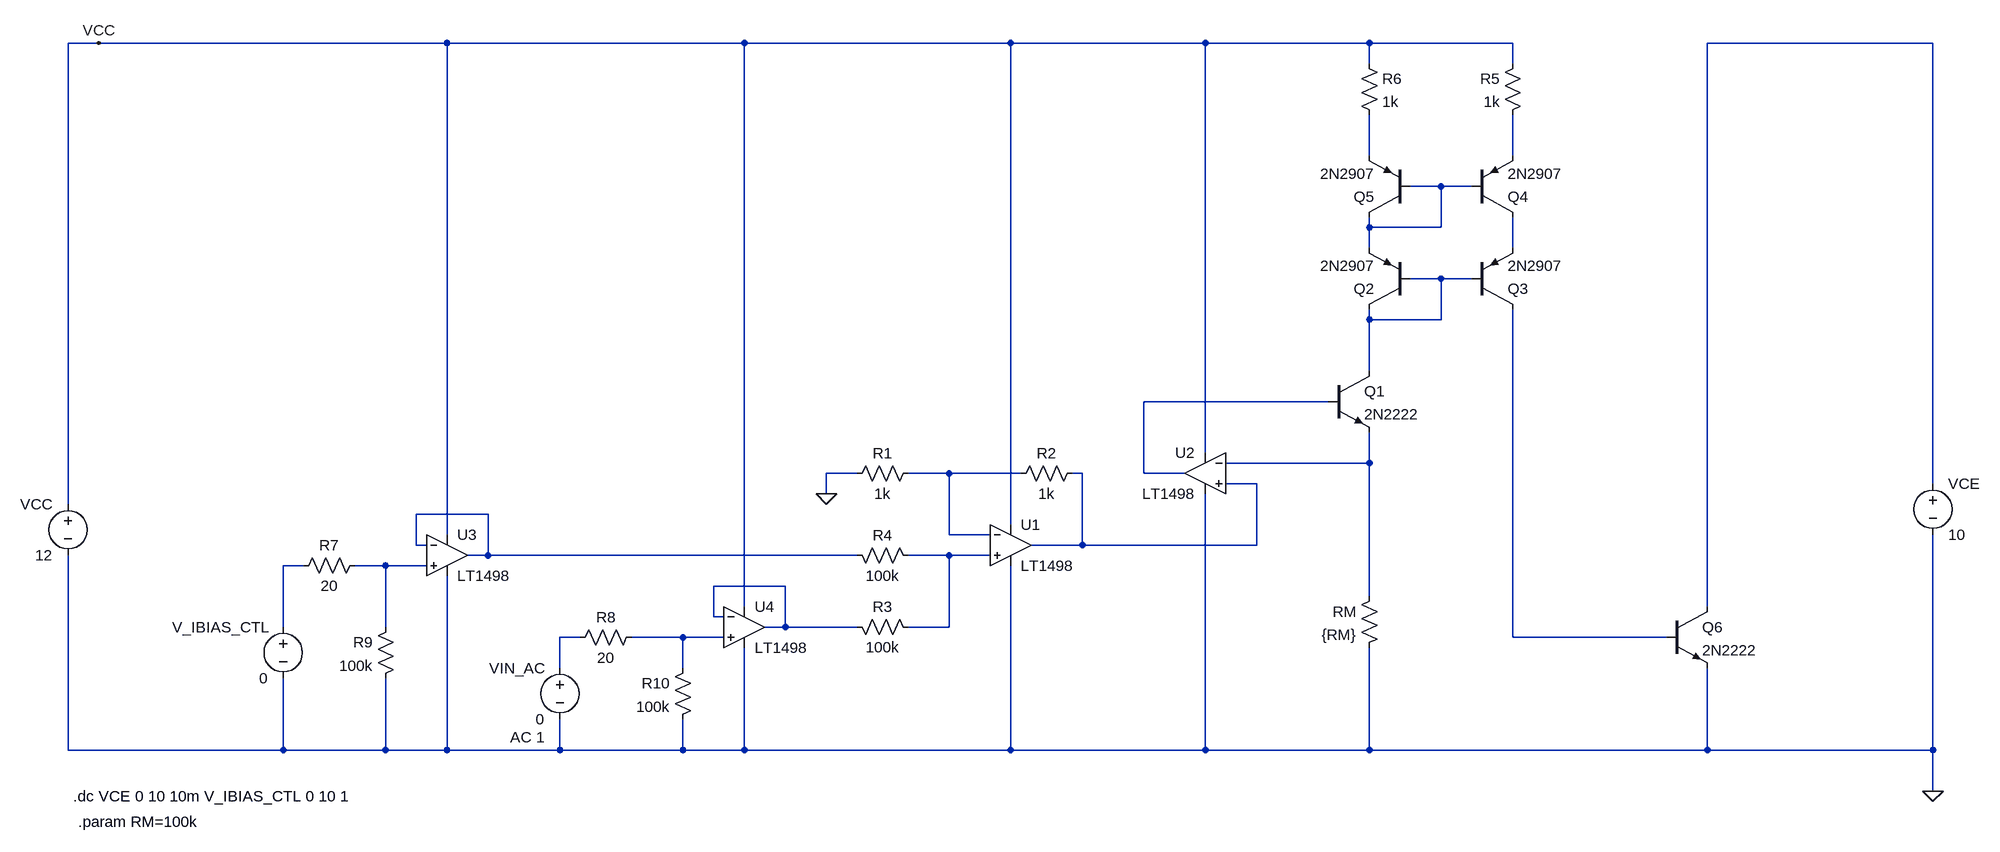
[diagram p0: schematic Draft1.asc]
Draft1.asc, the LTspice schematic file:
Version 4.1
SHEET 1 880 688
WIRE -2432 -544 -2480 -544
WIRE -1888 -544 -2432 -544
WIRE -1424 -544 -1888 -544
WIRE -1008 -544 -1424 -544
WIRE -704 -544 -1008 -544
WIRE -448 -544 -704 -544
WIRE -224 -544 -448 -544
WIRE 432 -544 80 -544
WIRE -448 -512 -448 -544
WIRE -224 -512 -224 -544
WIRE -448 -368 -448 -432
WIRE -224 -368 -224 -432
WIRE -336 -320 -384 -320
WIRE -288 -320 -336 -320
WIRE -448 -256 -448 -272
WIRE -336 -256 -336 -320
WIRE -336 -256 -448 -256
WIRE -448 -224 -448 -256
WIRE -224 -224 -224 -272
WIRE -336 -176 -384 -176
WIRE -288 -176 -336 -176
WIRE -448 -112 -448 -128
WIRE -336 -112 -336 -176
WIRE -336 -112 -448 -112
WIRE -448 -32 -448 -112
WIRE -512 16 -800 16
WIRE -704 96 -704 -544
WIRE -448 112 -448 64
WIRE -448 112 -672 112
WIRE -1248 128 -1296 128
WIRE -1104 128 -1168 128
WIRE -992 128 -1104 128
WIRE -896 128 -912 128
WIRE -800 128 -800 16
WIRE -736 128 -800 128
WIRE -624 144 -672 144
WIRE 432 144 432 -544
WIRE -1296 160 -1296 128
WIRE -2480 176 -2480 -544
WIRE -1824 192 -1936 192
WIRE -1008 208 -1008 -544
WIRE -1888 224 -1888 -544
WIRE -1104 224 -1104 128
WIRE -1040 224 -1104 224
WIRE -1936 240 -1936 192
WIRE -1920 240 -1936 240
WIRE -896 240 -896 128
WIRE -896 240 -976 240
WIRE -624 240 -624 144
WIRE -624 240 -896 240
WIRE -1824 256 -1824 192
WIRE -1824 256 -1856 256
WIRE -1248 256 -1824 256
WIRE -1104 256 -1168 256
WIRE -1040 256 -1104 256
WIRE -2112 272 -2144 272
WIRE -1984 272 -2032 272
WIRE -1920 272 -1984 272
WIRE -1360 304 -1472 304
WIRE -448 320 -448 112
WIRE -1424 336 -1424 -544
WIRE 80 336 80 -544
WIRE -1472 352 -1472 304
WIRE -1456 352 -1472 352
WIRE -2144 368 -2144 272
WIRE -1984 368 -1984 272
WIRE -1360 368 -1360 304
WIRE -1360 368 -1392 368
WIRE -1248 368 -1360 368
WIRE -1104 368 -1104 256
WIRE -1104 368 -1168 368
WIRE -1680 384 -1712 384
WIRE -1520 384 -1600 384
WIRE -1456 384 -1520 384
WIRE -224 384 -224 -128
WIRE 16 384 -224 384
WIRE -1712 432 -1712 384
WIRE -1520 432 -1520 384
WIRE -2480 560 -2480 256
WIRE -2144 560 -2144 448
WIRE -2144 560 -2480 560
WIRE -1984 560 -1984 448
WIRE -1984 560 -2144 560
WIRE -1888 560 -1888 288
WIRE -1888 560 -1984 560
WIRE -1712 560 -1712 512
WIRE -1712 560 -1888 560
WIRE -1520 560 -1520 512
WIRE -1520 560 -1712 560
WIRE -1424 560 -1424 400
WIRE -1424 560 -1520 560
WIRE -1008 560 -1008 272
WIRE -1008 560 -1424 560
WIRE -704 560 -704 160
WIRE -704 560 -1008 560
WIRE -448 560 -448 400
WIRE -448 560 -704 560
WIRE 80 560 80 432
WIRE 80 560 -448 560
WIRE 432 560 432 224
WIRE 432 560 80 560
WIRE 432 624 432 560
FLAG 432 624 0
FLAG -1296 160 0
FLAG -2432 -544 VCC
SYMBOL voltage 432 128 R0
WINDOW 123 0 0 Left 0
WINDOW 39 0 0 Left 0
SYMATTR InstName VCE
SYMATTR Value 10
SYMBOL npn -512 -32 R0
SYMATTR InstName Q1
SYMATTR Value 2N2222
SYMBOL voltage -2480 160 M0
WINDOW 123 0 0 Left 0
WINDOW 39 0 0 Left 0
SYMATTR InstName VCC
SYMATTR Value 12
SYMBOL OpAmps\\LT1498 -1008 176 R0
SYMATTR InstName U1
SYMBOL voltage -2144 352 M0
WINDOW 123 0 0 Left 0
WINDOW 39 0 0 Left 0
SYMATTR InstName V_IBIAS_CTL
SYMATTR Value 0
SYMBOL res -432 304 M0
SYMATTR InstName RM
SYMATTR Value {RM}
SYMBOL OpAmps\\LT1498 -704 64 M0
SYMATTR InstName U2
SYMBOL res -1264 144 R270
WINDOW 0 32 56 VTop 2
WINDOW 3 0 56 VBottom 2
SYMATTR InstName R1
SYMATTR Value 1k
SYMBOL voltage -1712 416 M0
WINDOW 123 24 124 Left 2
WINDOW 39 0 0 Left 0
SYMATTR InstName VIN_AC
SYMATTR Value 0
SYMATTR Value2 AC 1
SYMBOL res -1008 144 R270
WINDOW 0 32 56 VTop 2
WINDOW 3 0 56 VBottom 2
SYMATTR InstName R2
SYMATTR Value 1k
SYMBOL res -1152 384 M270
WINDOW 0 32 56 VTop 2
WINDOW 3 0 56 VBottom 2
SYMATTR InstName R3
SYMATTR Value 100k
SYMBOL pnp -384 -128 R180
SYMATTR InstName Q2
SYMATTR Value 2N2907
SYMBOL pnp -288 -128 M180
SYMATTR InstName Q3
SYMATTR Value 2N2907
SYMBOL pnp -288 -272 M180
SYMATTR InstName Q4
SYMATTR Value 2N2907
SYMBOL pnp -384 -272 R180
SYMATTR InstName Q5
SYMATTR Value 2N2907
SYMBOL res -208 -528 M0
SYMATTR InstName R5
SYMATTR Value 1k
SYMBOL res -464 -528 R0
SYMATTR InstName R6
SYMATTR Value 1k
SYMBOL npn 16 336 R0
SYMATTR InstName Q6
SYMATTR Value 2N2222
SYMBOL res -1152 272 M270
WINDOW 0 32 56 VTop 2
WINDOW 3 0 56 VBottom 2
SYMATTR InstName R4
SYMATTR Value 100k
SYMBOL OpAmps\\LT1498 -1888 192 R0
SYMATTR InstName U3
SYMBOL OpAmps\\LT1498 -1424 304 R0
SYMATTR InstName U4
SYMBOL res -2128 288 R270
WINDOW 0 32 56 VTop 2
WINDOW 3 0 56 VBottom 2
SYMATTR InstName R7
SYMATTR Value 20
SYMBOL res -1696 400 R270
WINDOW 0 32 56 VTop 2
WINDOW 3 0 56 VBottom 2
SYMATTR InstName R8
SYMATTR Value 20
SYMBOL res -1968 352 M0
SYMATTR InstName R9
SYMATTR Value 100k
SYMBOL res -1504 416 M0
SYMATTR InstName R10
SYMATTR Value 100k
TEXT -2472 632 Left 2 !.dc VCE 0 10 10m V_IBIAS_CTL 0 10 1
TEXT -2464 672 Left 2 !.param RM=100k

The netlist it stands for:
* Draft1.asc
VCE N001 0 10
Q1 N006 N007 N008 0 2N2222
VCC VCC 0 12
X§U1 N012 N009 VCC 0 N010 LT1498  ; pins In+ In- V+ V- OUT
V_IBIAS_CTL N013 0 0
RM N008 0 {RM}
X§U2 N010 N008 VCC 0 N007 LT1498  ; pins In+ In- V+ V- OUT
R1 0 N009 1k
VIN_AC N016 0 0 AC 1
R2 N009 N010 1k
R3 N012 N015 100k
Q2 N006 N006 N004 0 2N2907
Q3 N018 N006 N005 0 2N2907
Q4 N005 N004 N003 0 2N2907
Q5 N004 N004 N002 0 2N2907
R5 VCC N003 1k
R6 VCC N002 1k
Q6 N001 N018 0 0 2N2222
R4 N012 N011 100k
X§U3 N014 N011 VCC 0 N011 LT1498  ; pins In+ In- V+ V- OUT
X§U4 N017 N015 VCC 0 N015 LT1498  ; pins In+ In- V+ V- OUT
R7 N013 N014 20
R8 N016 N017 20
R9 N014 0 100k
R10 N017 0 100k
.model NPN NPN
.model PNP PNP
.lib standard.bjt
.dc VCE 0 10 10m V_IBIAS_CTL 0 10 1
.param RM=100k
.lib LTC.lib
.backanno
.end